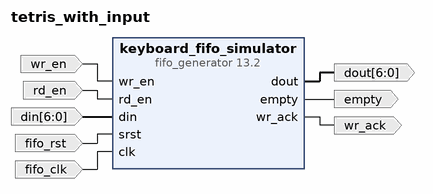
[diagram p0: block diagram of the top level]
# Vivado block design tetris_with_input, xc7a100tcsg324-1, Vivado 2018.2
create_bd_design tetris_with_input

create_bd_port -dir I wr_en
create_bd_port -dir I rd_en
create_bd_port -dir O empty
create_bd_port -dir O -from 6 -to 0 dout
create_bd_port -dir I -from 6 -to 0 din
create_bd_port -dir I fifo_rst
create_bd_port -dir O wr_ack
create_bd_port -dir I -type clk fifo_clk
set_property -dict {CONFIG.FREQ_HZ 2500000} [get_bd_ports fifo_clk]

create_bd_cell -type ip -vlnv xilinx.com:ip:fifo_generator:13.2 keyboard_fifo_simulator
set_property -dict [list \
  CONFIG.Fifo_Implementation Common_Clock_Block_RAM \
  CONFIG.Performance_Options First_Word_Fall_Through \
  CONFIG.Input_Data_Width 7 \
  CONFIG.Output_Data_Width 7 \
  CONFIG.Reset_Type Synchronous_Reset \
  CONFIG.Use_Dout_Reset true \
  CONFIG.Valid_Flag false \
  CONFIG.Write_Acknowledge_Flag true \
] [get_bd_cells keyboard_fifo_simulator]

# ---- connections ----

connect_bd_net -net wr_en_0_1 [get_bd_ports wr_en] [get_bd_pins keyboard_fifo_simulator/wr_en]
connect_bd_net -net rd_en_0_1 [get_bd_ports rd_en] [get_bd_pins keyboard_fifo_simulator/rd_en]
connect_bd_net -net fifo_generator_0_empty [get_bd_pins keyboard_fifo_simulator/empty] [get_bd_ports empty]
connect_bd_net -net fifo_generator_0_dout [get_bd_pins keyboard_fifo_simulator/dout] [get_bd_ports dout]
connect_bd_net -net din_0_1 [get_bd_ports din] [get_bd_pins keyboard_fifo_simulator/din]
connect_bd_net [get_bd_pins keyboard_fifo_simulator/wr_ack] [get_bd_ports wr_ack]
connect_bd_net [get_bd_ports fifo_rst] [get_bd_pins keyboard_fifo_simulator/srst]
connect_bd_net -net clk_0_1 [get_bd_ports fifo_clk] [get_bd_pins keyboard_fifo_simulator/clk]

validate_bd_design
save_bd_design
